# EAGLE design Top board Full (EAGLE 7.4.0)
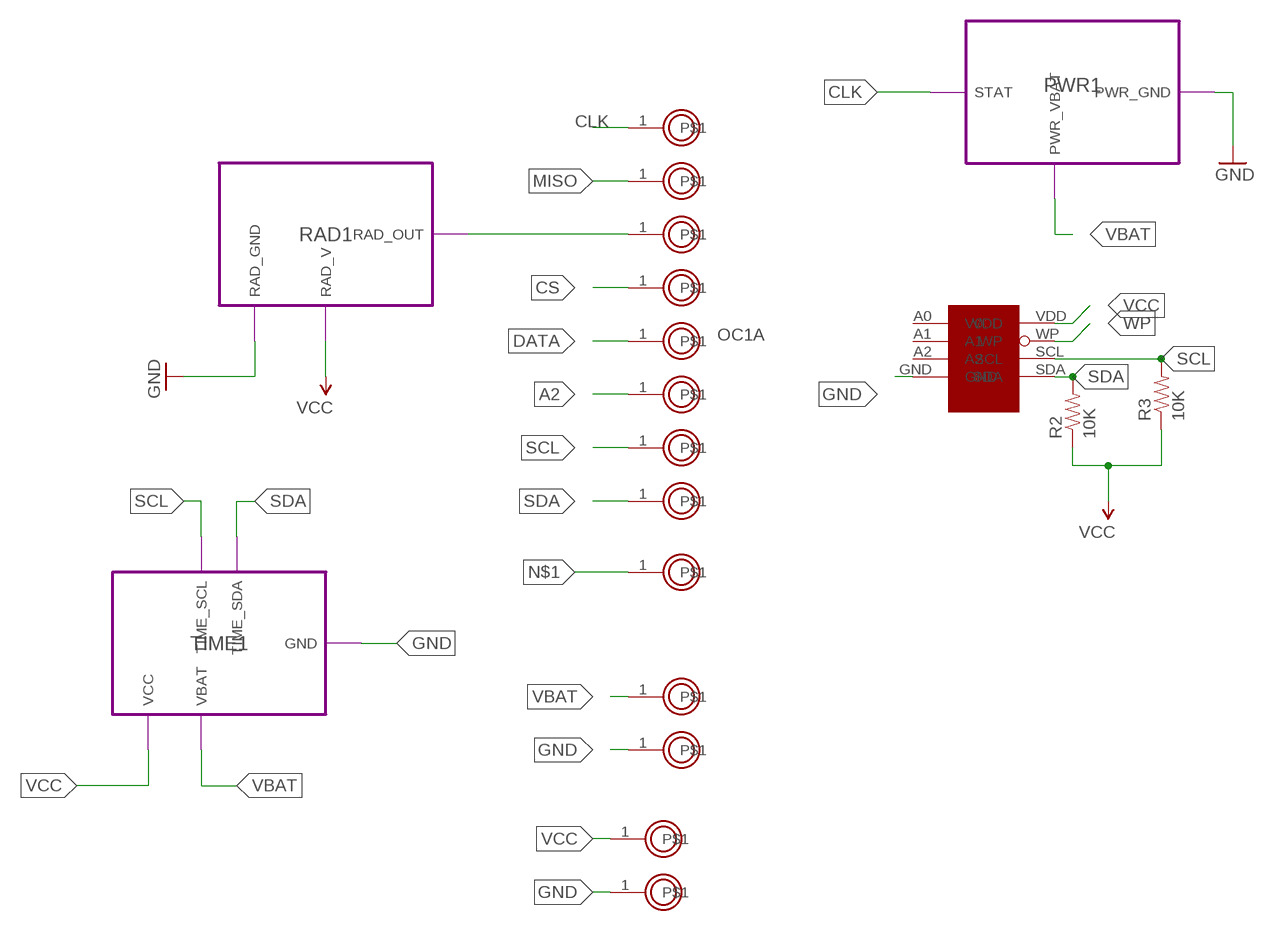
[diagram p0: schematic, sheet 1]

## Parts
0  PROTO_POINT  [1X01]
1  PROTO_POINT  [1X01]
2  PROTO_POINT  [1X01]
3  PROTO_POINT  [1X01]
4  PROTO_POINT  [1X01]
5  PROTO_POINT  [1X01]
A0  PROTO_POINT  [1X01]
A1  PROTO_POINT  [1X01]
BAT  PROTO_POINT  [1X01]
FRAM  MB85RC256V  MB85RC256VMB85RC256V  [SO08]
GND@2  PROTO_POINT  [1X01]
GND@3  PROTO_POINT  [1X01]
R2  10K  10KOHM-1/10W-1%(0603)0603  [0603-RES]
R3  10K  10KOHM-1/10W-1%(0603)0603  [0603-RES]
RESET  PROTO_POINT  [1X01]
VCC  PROTO_POINT  [1X01]

## Module instances
PWR1 = PWR
RAD1 = RAD
TIME1 = TIME

## Nets
A2: 0.1
CLK: 5.1 ; port PWR1.STAT
CS: 2.1
DATA: 1.1
GND: FRAM.GND GND@2.1 GND@3.1 ; port RAD1.RAD_GND PWR1.PWR_GND TIME1.GND
MISO: 4.1
MOSI: 3.1 ; port RAD1.RAD_OUT
N$1: RESET.1
SCL: A1.1 FRAM.SCL R3.2 ; port TIME1.TIME_SCL
SDA: A0.1 FRAM.SDA R2.2 ; port TIME1.TIME_SDA
VBAT: BAT.1 ; port PWR1.PWR_VBAT TIME1.VBAT
VCC: FRAM.VDD R2.1 R3.1 VCC.1 ; port RAD1.RAD_V TIME1.VCC
WP: FRAM.WP
Unconnected: FRAM.A0(V0) FRAM.A1 FRAM.A2

## Notes on the sheet
- OC1A

## Library data of the parts
0 1-5 A0 A1 BAT GND@2 GND@3 RESET VCC = BLEduino Bean:PROTO_POINT
FRAM = radiationbean:MB85RC256V
R2 R3 = SparkFun-Resistors:10KOHM-1/10W-1%(0603): RES-00824; PROD_ID: RES-00824

## Module PWR
Ports: STAT(out) PWR_GND(pwr) PWR_VBAT(pwr)
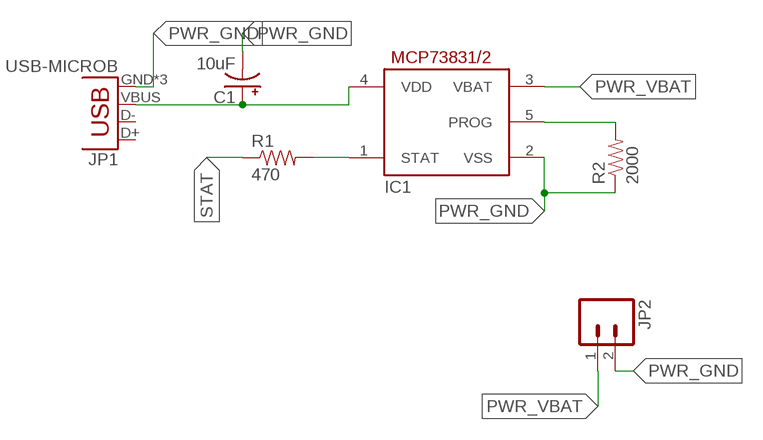
[diagram p1: schematic, module PWR, sheet 1]

### Parts
C1  10uF  10UF-16V-10%(TANT)  [EIA3216]
IC1  MCP73831/OT  [SOT23-5L]
JP1  USB-MICROB  [USB-MICROB]
JP2  M02POLAR_LOCK  [MOLEX-1X2_LOCK]
R1  470  4.7KOHM-1/10W-1%(0603)  [0603-RES]
R2  2000  4.7KOHM-1/10W-1%(0603)  [0603-RES]

### Nets
N$1: IC1.1(STAT) R1.2
N$2: IC1.5(PROG) R2.2
PWR_GND: C1.C(-) IC1.2(VSS) JP1.GND JP1.MT1(GND) JP1.MT2(GND) JP2.2 R2.1
PWR_VBAT: IC1.3(VBAT) JP2.1
STAT: R1.1
VBUS: C1.A(+) IC1.4(VDD) JP1.VBUS
Unconnected: JP1.D+ JP1.D-

### Library data of the parts
C1 = SparkFun-Capacitors:10UF-16V-10%(TANT): CAP-00811 1206/EIA-3216 Tantalum capacitor; PROD_ID: CAP-00811
IC1 = adafruit:MCP73831: MCP73831/2 Miniature Single-Cell, Fully Integrated Li-Ion, Li-Polymer Charge Management Controllers. Nice and small simple lipoly charge controller, with adjustable current and status output (LED) http://www.ladyada.net/library/pcb/eaglelibrary.html
JP1 = SparkFun-Connectors:USB: USB Connectors USB-B-PTH is fully proven SKU : PRT-00139/CONN-08278 USB-miniB is fully proven SKU : PRT-00587 USB-A-PCB is untested. USB-A-H is throughly reviewed, but untested. Spark Fun Electronics SKU : PRT-00437 USB-B-SMT is throughly reviewed, but untested. Needs silkscreen touching up. USB-A-S has not been used/tested USB-MB-H has not been used/tested USB-MICROB has been used. CONN-09505; PROD_ID: CONN-09505
JP2 = SparkFun-Connectors:M02: Standard 2-pin 0.1" header. Use with - straight break away headers ( PRT-00116) - right angle break away headers (PRT-00553) - swiss pins (PRT-00743) - machine pins (PRT-00117) - female headers (PRT-00115) Molex polarized connector foot print use with: PRT-08233 with associated crimp pins and housings. 2.54_SCREWTERM for use with PRT-10571. 3.5mm Screw Terminal footprints for PRT-08084 5mm Screw Terminal footprints for use with PRT-08432
R1 R2 = SparkFun-Resistors:4.7KOHM-1/10W-1%(0603): RES-07857; PROD_ID: RES-07857; VALUE: 4.7K

## Module RAD
Ports: RAD_OUT(out) RAD_V(io) RAD_GND(pwr)
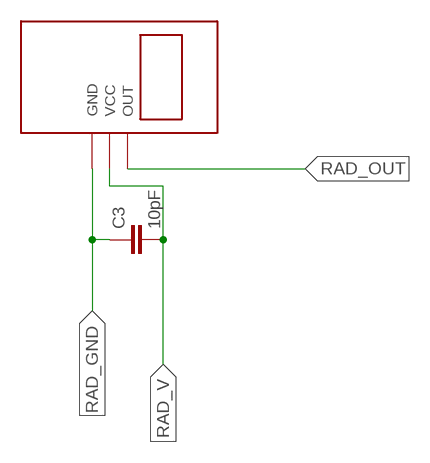
[diagram p2: schematic, module RAD, sheet 1]

### Parts
C3  10pF  10PF-50V-5%(0603)  [0603-CAP]
U$1  RD2007  [RD2007]

### Nets
RAD_GND: C3.1 U$1.GND
RAD_OUT: U$1.OUT
RAD_V: C3.2 U$1.VCC

### Library data of the parts
C3 = SparkFun-Capacitors:10PF-50V-5%(0603): CAP-11812; PROD_ID: CAP-11812
U$1 = radiationbean:RD2007

## Module TIME
Ports: TIME_SCL(io) TIME_SDA(io) GND(io) VBAT(io) VCC(io)
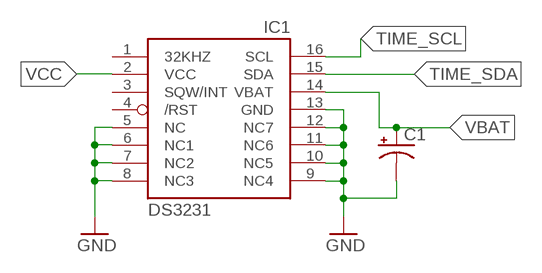
[diagram p3: schematic, module TIME, sheet 1]

### Parts
C1  CPOL-USA/3216-18R  [A/3216-18R]
IC1  DS3231  [SO16]

### Nets
GND: C1.- IC1.5(NC) IC1.6(NC1) IC1.7(NC2) IC1.8(NC3) IC1.9(NC4) IC1.10(NC5) IC1.11(NC6) IC1.12(NC7) IC1.13(GND)
TIME_SCL: IC1.16(SCL)
TIME_SDA: IC1.15(SDA)
VBAT: C1.+ IC1.14(VBAT)
VCC: IC1.2(VCC)
Unconnected: IC1.1(32KHZ) IC1.3(SQW/INT) IC1.4(/RST)

### Library data of the parts
C1 = adafruit:CPOL-US: POLARIZED CAPACITOR, American symbol
IC1 = radiationbean:DS3231

## Board
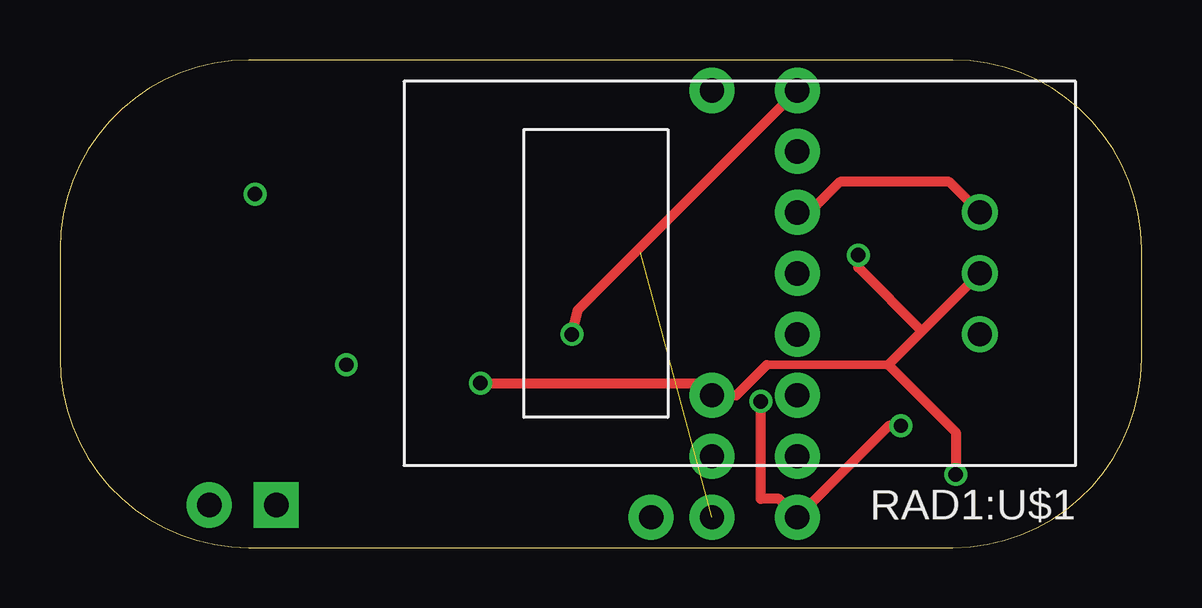
[diagram p4: board, top side]
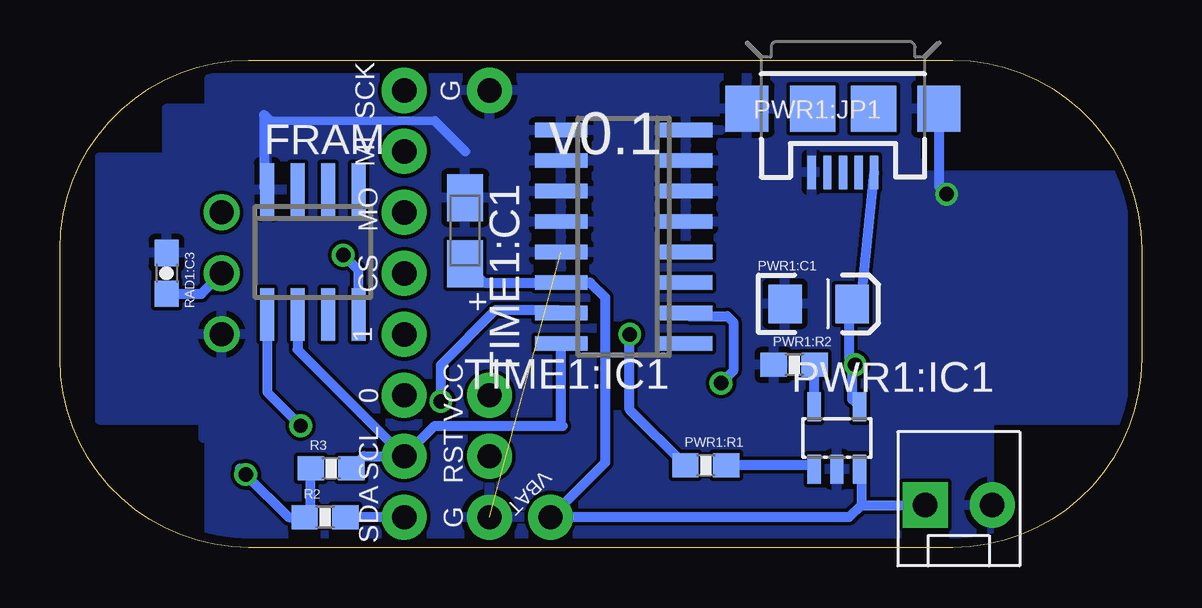
[diagram p5: board, bottom side, seen from below]

Size 45.09 x 20.32 mm. Coordinates in mm from the lower left corner, seen from the top.
Outline: 0,12.45 0,7.87 arc90 7.87,0 37.21,0 arc90 45.09,7.87 45.09,12.45 arc90 37.21,20.32 7.87,20.32 arc90 0,12.45
Copper layers (1*16): Top 0.0356mm / dielectric 1.5011mm / Bottom 0.0356mm
Design rules "oshPark": minimum track width 6mil, minimum drill 13mil, track to track 6mil, track to pad 6mil, pad to pad 6mil, via to via 6mil, smd to smd 6mil, copper to edge 15mil, drill to drill 6mil, minimum pad ring 7mil, minimum via ring 7mil, stop-mask expansion 3mil, vias tented up to drill 0mil, thermal gap 10mil

### Footprints (pad centres in the part's own frame; a part is rotated, then mirrored left to right if it is on the bottom)
1X01 = drill 1.016 pad 1.88: 1 0,0
SO08 = smd 0.6 x 2.2: A0 -1.905,-2.6; A1 -0.635,-2.6; A2 0.635,-2.6; GND 1.905,-2.6; SCL 0.635,2.6; SDA 1.905,2.6; VDD -1.905,2.6; WP -0.635,2.6
EIA3216 = smd 1.4 x 1.6: A 1.4,0; C -1.4,0
SOT23-5L = smd 0.55 x 1.2: 1 -0.95,-1.3; 2 0,-1.3; 3 0.95,-1.3; 4 0.95,1.3; 5 -0.95,1.3
USB-MICROB = smd 0.35 x 1.4: D+ 0,2.65; D- -0.65,2.65; GND 1.3,2.65; ID 0.65,2.65; VBUS -1.3,2.65 | smd 1.8 x 1.9: MT1 -4,0; MT2 4,0 | smd 1.9 x 1.9: P$1 -1.27,0; P$2 1.27,0
MOLEX-1X2_LOCK = drill 1.016 pad 1.88 square: 1 -0.127,0 | drill 1.016 pad 1.88: 2 2.667,0
0603-RES = smd 1.1 x 1: 1 -0.85,0; 2 0.85,0
0603-CAP = smd 1.1 x 1: 1 -0.85,0; 2 0.85,0
RD2007 = drill 1: GND 0.012,2.539; OUT 0.012,-2.541; VCC 0.012,-0.001
A/3216-18R = smd 1.95 x 1.5: + 1.375,0; - -1.375,0
SO16 = smd 0.6 x 2.2: 1 -4.445,-2.6; 2 -3.175,-2.6; 3 -1.905,-2.6; 4 -0.635,-2.6; 5 0.635,-2.6; 6 1.905,-2.6; 7 3.175,-2.6; 8 4.445,-2.6; 9 4.445,2.6; 10 3.175,2.6; 11 1.905,2.6; 12 0.635,2.6; 13 -0.635,2.6; 14 -1.905,2.6; 15 -3.175,2.6; 16 -4.445,2.6

### Placement (x,y rotation side)
0  30.73,6.35 0 top
1  30.73,8.89 0 top
2  30.73,11.43 0 top
3  30.73,13.97 0 top
4  30.73,16.51 0 top
5  30.73,19.05 0 top
A0  30.73,1.27 0 top
A1  30.73,3.81 0 top
BAT  24.64,1.27 0 top
FRAM  34.54,12.32 180 bottom
GND@2  27.18,1.27 0 top
GND@3  27.18,19.05 0 top
PWR1:C1  10uF  [EIA3216]  13.46,10.16 0 bottom
PWR1:IC1  MCP73831/OT  [SOT23-5L]  12.7,4.57 0 bottom
PWR1:JP1  USB-MICROB  [USB-MICROB]  12.45,18.29 180 bottom
PWR1:JP2  [MOLEX-1X2_LOCK]  8.89,1.78 0 bottom
PWR1:R1  470  [0603-RES]  18.16,3.43 0 bottom
PWR1:R2  2000  [0603-RES]  14.48,7.62 0 bottom
R2  34.04,1.27 0 bottom
R3  33.78,3.3 0 bottom
RAD1:C3  10pF  [0603-CAP]  40.64,11.43 270 bottom
RAD1:U$1  RD2007  [RD2007]  38.35,11.43 180 top
RESET  27.18,3.81 0 top
TIME1:C1  [A/3216-18R]  28.19,13.21 270 bottom
TIME1:IC1  DS3231  [SO16]  21.59,12.95 90 bottom
VCC  27.18,6.35 0 top

### Tracks (layer width: path | path; a pad name or v marks a point on that pad's centre or on a via)
CLK  (via drill 0.6)
  Top 0.406: v21.34,8.89 21.59,9.91 5.1
  Bottom 0.406: PWR1:R1.1 21.34,5.75 v21.34,8.89
GND  (via drill 0.6)  (1 unrouted)
  Bottom 0.356: 29.46,17.78 36.32,17.78
  Bottom 0.406: 28.19,16.51 29.46,17.78 | 36.32,17.78 36.58,18.03 36.58,15.05 FRAM.GND | PWR1:JP1.MT1 8.45,15.05 v8.13,14.73
  pour Bottom: 43.43,16.26 43.43,5.33 39.12,5.33 39.12,4.57 38.86,4.57 38.86,0.51 6.35,0.51 6.35,5.33 0.76,5.33 0.76,15.49 9.14,15.49 9.14,16 9.4,16 9.4,19.56 38.86,19.56 38.86,18.29 40.64,18.29 40.64,16.26
MOSI
  Top 0.406: RAD1:U$1.OUT 37.07,15.24 32.51,15.24 31.24,13.97 3.1
PWR1:N$1
  Bottom 0.406: PWR1:IC1.1 13.81,3.43 PWR1:R1.2
PWR1:N$2
  Bottom 0.406: PWR1:IC1.5 13.63,5.89 PWR1:R2.2
PWR1:VBUS  (via drill 0.6)
  Bottom 0.406: PWR1:IC1.4 12.06,6.18 12.06,7.5 v11.94,7.62 12.19,7.87 12.19,9.91 12.06,10.04 PWR1:C1.A 11.65,10.57 PWR1:JP1.VBUS
SCL
  Bottom 0.406: R3.2 32.42,3.81 A1.1 | FRAM.SCL 35.18,8.26 A1.1 | A1.1 29.46,5.08 24.13,5.08 24.19,5.14 TIME1:IC1.16
SDA  (via drill 0.6)
  Top 0.406: v35.05,5.08 34.54,5.08 A0.1 29.97,2.03 29.21,2.03 v29.21,6.1
  Bottom 0.406: A0.1 R2.2 | FRAM.SDA 36.45,6.48 v35.05,5.08 | v29.21,6.1 29.21,7.62 26.92,9.91 24.32,9.91 TIME1:IC1.15
VBAT
  Bottom 0.406: PWR1:IC1.3 11.68,3.21 11.68,1.78 | 11.68,1.78 12.19,1.27 BAT.1 22.35,3.56 22.35,10.41 22.99,11.05 TIME1:IC1.14 27.41,11.05 TIME1:C1.+ | 11.68,1.78 PWR1:JP2.1
VCC  (via drill 0.6)
  Top 0.356: 29.46,7.62 34.53,7.62
  Top 0.406: 29.46,7.62 28.19,6.35 VCC.1 26.67,6.86 v17.53,6.86 | v37.34,3.05 37.34,4.81 34.53,7.62 35.93,9.02 | RAD1:U$1.VCC 35.93,9.02 | v33.27,12.19 33.27,11.68 35.93,9.02
  Bottom 0.406: R3.1 34.63,1.52 R2.1 35.56,1.27 v37.34,3.05 37.59,3.3 | TIME1:IC1.2 18.86,9.65 17.27,9.65 17.02,9.4 17.02,7.37 v17.53,6.86 | RAD1:C3.2 39.19,10.58 RAD1:U$1.VCC | FRAM.VDD 32.64,11.56 v33.27,12.19

### Text on the board
bNames: G | SCK | v0.1 | MI | MO | CS | 1 | VCC | 0 | RST | SCL | VBAT | G | SDA
bValues: VBAT
bDocu: Rev B